# EAGLE schematic schematic_full (EAGLE 6.2)
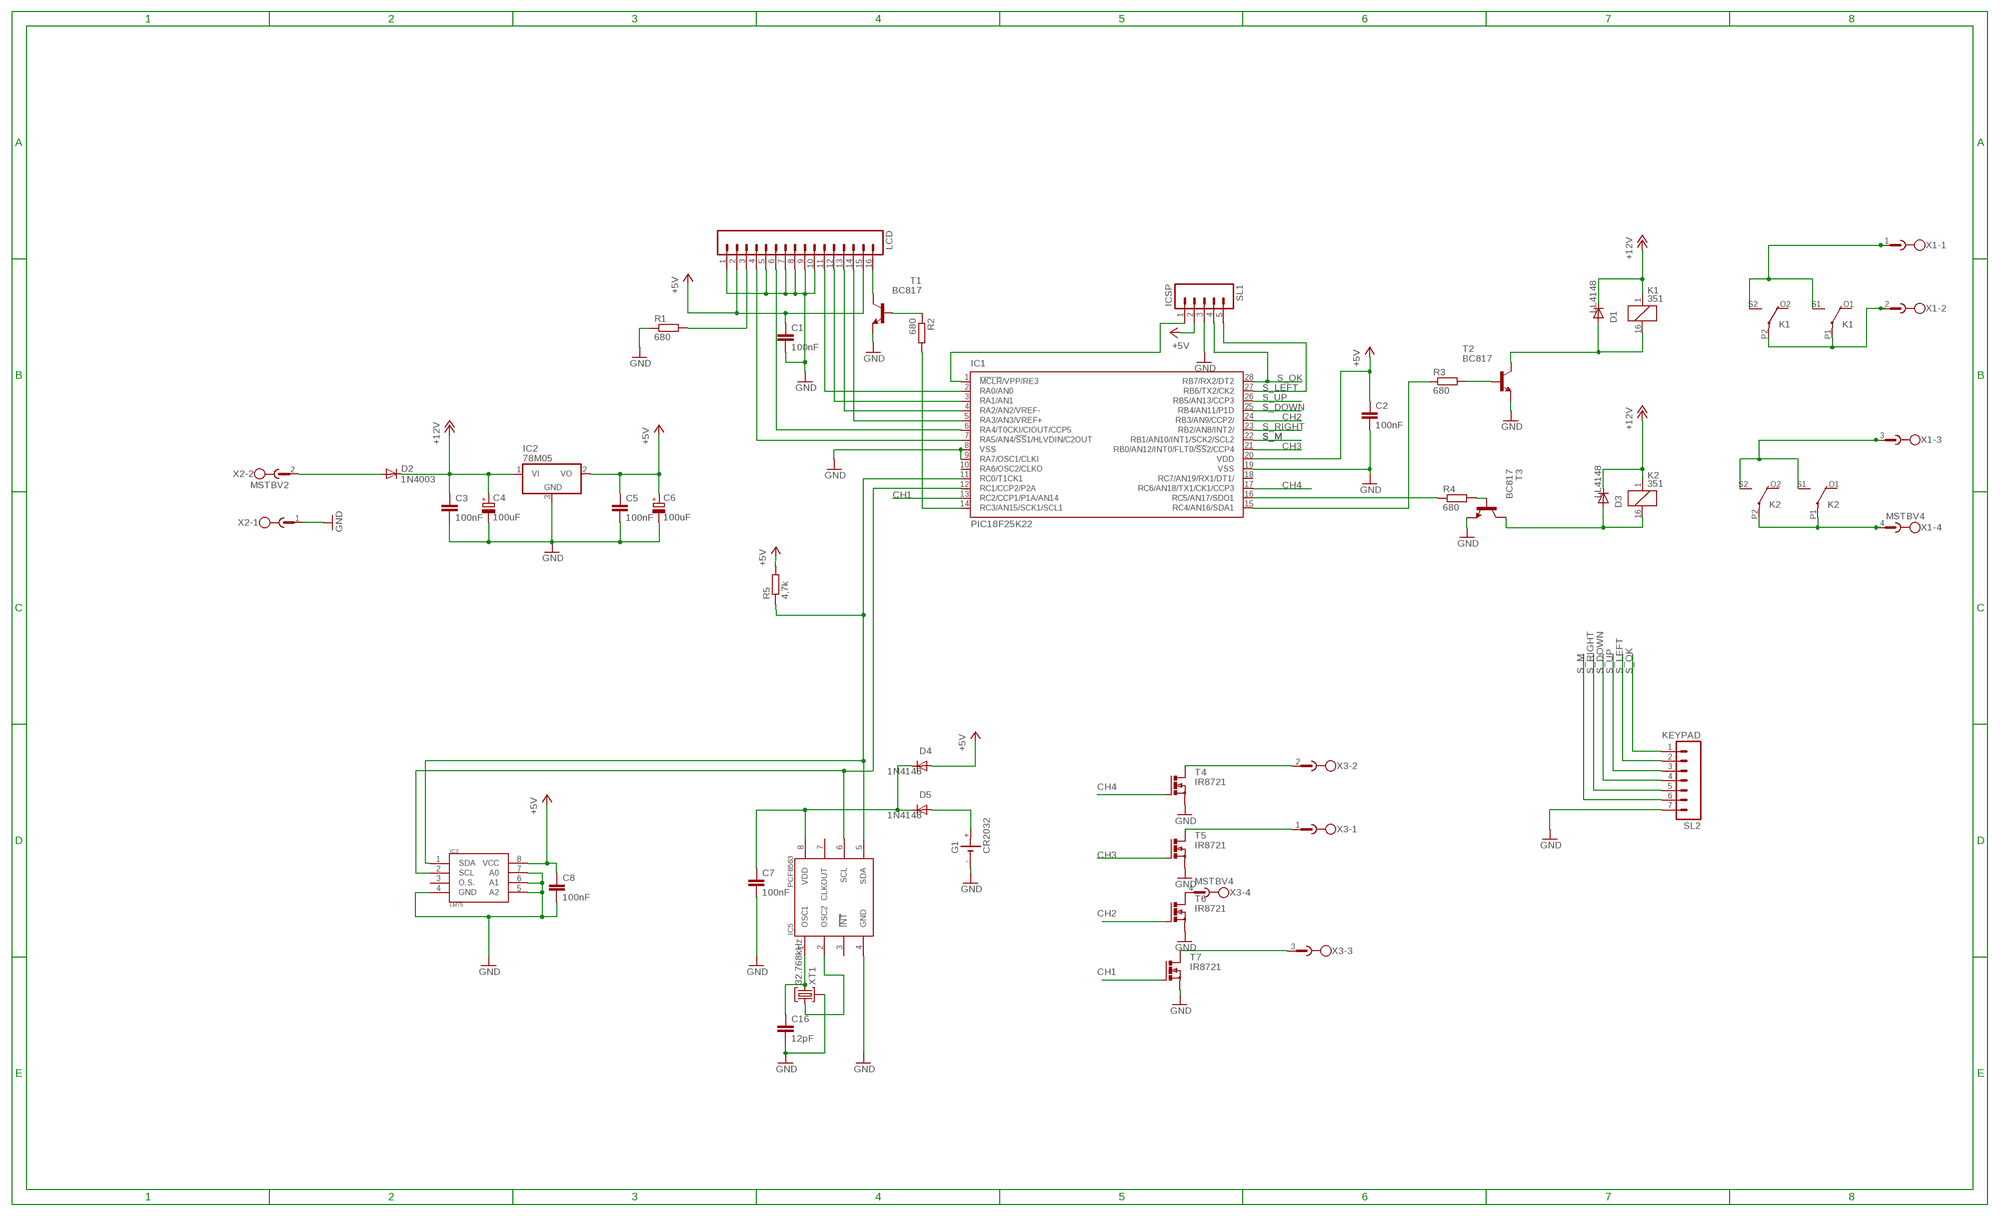
[diagram p0: schematic, sheet 1]

## Parts
C1  100nF  C-EUC0805K  [C0805K]
C2  100nF  C-EUC0805K  [C0805K]
C3  100nF  C-EUC0805K  [C0805K]
C4  100uF  CPOL-EUE2,5-6E  [E2,5-6E]
C5  100nF  C-EUC0805K  [C0805K]
C6  100uF  CPOL-EUE2.5-6  [E2,5-6]
C7  100nF  C-EUC0805K  [C0805K]
C8  100nF  C-EUC0805K  [C0805K]
C16  12pF  C-EUC0805K  [C0805K]
D1  LL4148  DIODE-DO214BA  [DO214BA]
D2  1N4003  1N4933  [DO41-10]
D3  LL4148  DIODE-DO214BA  [DO214BA]
D4  1N4148  DIODE-DO214BA  [DO214BA]
D5  1N4148  DIODE-DO214BA  [DO214BA]
G1  CR2032  [CR2032]
IC1  PIC18F25K22  PIC18F25K22-E/SS  [SSOP28]
IC2  78M05  7805DT  [TO252]
IC3  LM75  [SO08]
IC5  PCF8563  [SO08]
K1  351  [351]
K2  351  [351]
LCD  M16  [16P]
R1  680  R-EU_M0805  [M0805]
R2  680  R-EU_M0805  [M0805]
R3  680  R-EU_M0805  [M0805]
R4  680  R-EU_M0805  [M0805]
R5  4,7k  R-EU_M0805  [M0805]
SL1  ICSP  M05  [05P]
SL2  KEYPAD  MA07  [07PA]
T1  BC817  BC817-40SMD  [SOT23-BEC]
T2  BC817  BC817-40SMD  [SOT23-BEC]
T3  BC817  BC817-40SMD  [SOT23-BEC]
T4  IR8721  IRLR120N  [TO252]
T5  IR8721  IRLR120N  [TO252]
T6  IR8721  IRLR120N  [TO252]
T7  IR8721  IRLR120N  [TO252]
X1  MSTBV4  [MSTBV4]
X2  MSTBV2  [MSTBV2]
X3  MSTBV4  [MSTBV4]
XT1  32.768kHz  XTMINI  [XTMINI]

## Nets
+5V: C1.1 C2.1 C5.1 C6.+ C8.1 D4.A IC1.20(VDD) IC2.2(VO) IC3.8(VCC) LCD.2 LCD.15 R5.2 SL1.2
+12V: C3.1 C4.+ D1.C D2.C D3.C IC2.1(VI) K1.1 K2.1
CH1: IC1.13(RC2/CCP1/P1A/AN14) T7.1(G)
CH2: IC1.24(RB3/AN9/CCP2/) T6.1(G)
CH3: IC1.21(RB0/AN12/INT0/FLT0/!SS!2/CCP4) T5.1(G)
CH4: IC1.17(RC6/AN18/TX1/CK1/CCP3) T4.1(G)
GND: C1.2 C2.2 C3.2 C4.- C5.2 C6.- C7.2 C8.2 C16.2 G1.- IC1.8(VSS) IC1.9(RA7/OSC1/CLKI) IC1.19(VSS) IC2.3(GND) IC3.4(GND) IC3.5(A2) IC3.6(A1) IC3.7(A0) IC5.4(GND) LCD.1 LCD.5 LCD.7 LCD.8 LCD.9 LCD.10 R1.1 SL1.3 SL2.7 T1.E T2.E T3.E T4.3(S) T5.3(S) T6.3(S) T7.3(S) X2.1 XT1.P$3
N$1: D5.A G1.+
N$2: K1.S1(2:S) K1.S2(3:S) X1.1
N$3: K2.P1(2:P) K2.P2(3:P) X1.4
N$4: T5.2(D) X3.1
N$5: D2.A X2.2
N$6: IC1.15(RC4/AN16/SDA1) R3.1
N$7: T4.2(D) X3.2
N$8: IC5.2(OSC2) XT1.P$1
N$9: T6.2(D) X3.4
N$10: IC1.11(RC0/T1CK1) IC3.1(SDA) IC5.5(SDA) R5.1
N$11: IC1.12(RC1/CCP2/P2A) IC3.2(SCL) IC5.6(SCL)
N$12: C7.1 D4.C D5.C IC5.8(VDD)
N$13: IC1.2(RA0/AN0) LCD.11
N$14: IC1.3(RA1/AN1) LCD.12
N$15: IC1.4(RA2/AN2/VREF-) LCD.13
N$16: IC1.5(RA3/AN3/VREF+) LCD.14
N$17: IC1.6(RA4/T0CKI/CIOUT/CCP5) LCD.6
N$18: T7.2(D) X3.3
N$19: IC1.7(RA5/AN4/!SS!1/HLVDIN/C2OUT) LCD.4
N$20: LCD.3 R1.2
N$23: D1.A K1.16 T2.C
N$24: C16.1 IC5.1(OSC1) XT1.P$2
N$26: D3.A K2.16 T3.C
N$27: LCD.16 T1.C
N$28: R4.2 T3.B
N$29: R3.2 T2.B
N$30: K1.P1(2:P) K1.P2(3:P) X1.2
N$31: IC1.16(RC5/AN17/SDO1) R4.1
N$32: R2.1 T1.B
N$34: IC1.14(RC3/AN15/SCK1/SCL1) R2.2
N$55: IC1.1(!MCLR!/VPP/RE3) SL1.1
S_DOWN: IC1.25(RB4/AN11/P1D) SL2.4
S_LEFT: IC1.27(RB6/TX2/CK2) SL1.5 SL2.2
S_M: IC1.22(RB1/AN10/INT1/SCK2/SCL2) SL2.6
S_OK: IC1.28(RB7/RX2/DT2) SL1.4 SL2.1
S_RIGHT: IC1.23(RB2/AN8/INT2/) SL2.5
S_UP: IC1.26(RB5/AN13/CCP3) SL2.3
SWITCH2_IN: K2.S1(2:S) K2.S2(3:S) X1.3
Unconnected: IC1.10(RA6/OSC2/CLKO) IC1.18(RC7/AN19/RX1/DT1/) IC3.3(O.S.) IC5.3(INT) IC5.7(CLKOUT) K1.O1(2:O) K1.O2(3:O) K2.O1(2:O) K2.O2(3:O)

## Library data of the parts
C1-C3 C5 C7 C8 C16 = rcl:C-EU: CAPACITOR, European symbol
C4 C6 = rcl:CPOL-EU: POLARIZED CAPACITOR, European symbol
D1 D3-D5 = diode:DIODE-: DIODE
D2 = diode:1N4933: DIODE fast recovery rectifier, 1A
G1 = battery:CR2032
IC1 = pic18f25k22:PIC18F25K22: PIC18F25K22 28 pin DIP
IC2 = linear:78*: Positive VOLTAGE REGULATOR Source: http://cache.national.com/ds/LM/LM78L05.pdf http://www.fairchildsemi.com/ds/LM/LM7805.pdf
IC3 = linear:LM75
IC5 = philips:PCF8563
K1 K2 = relay:351: RELAY 2 x switch, Omron
LCD = con-amp-quick:M16: AMP QUICK CONNECTOR; OC_FARNELL: unknown; OC_NEWARK: unknown
R1-R5 = resistor:R-EU_: RESISTOR, European symbol
SL1 = con-amp-quick:M05: AMP QUICK CONNECTOR
SL2 = con-amp-quick:MA07: AMP QUICK CONNECTOR
T1-T3 = transistor-npn:BC817*: NPN Transistor
T4-T7 = transistor-power:IRLR120N
X1 X3 = con-phoenix-508:MSTBV4: PHOENIX; MPN: MSTBV 2,5/4-GF-5.08; OC_FARNELL: 1792794; OC_NEWARK: 69R9847
X2 = con-phoenix-508:MSTBV2: PHOENIX; MPN: MSTBV 2,5/2-GF-5.08; OC_FARNELL: 1792792; OC_NEWARK: 69R9845
XT1 = crystal:XTMINI